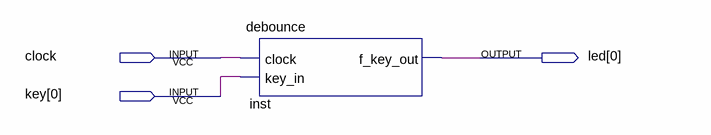
[diagram p0: schematic sheet]
// Quartus schematic debounce_teste.bdf as structural Verilog: 1 symbols, 3 pins
module debounce_teste (
  input  clock,
  input  [0:0] key,
  output [0:0] led
);

  debounce inst (.clock(clock), .key_in(key[0]), .f_key_out(led[0]));
endmodule
